# EAGLE design PowerCell-v13 (EAGLE 6.2)
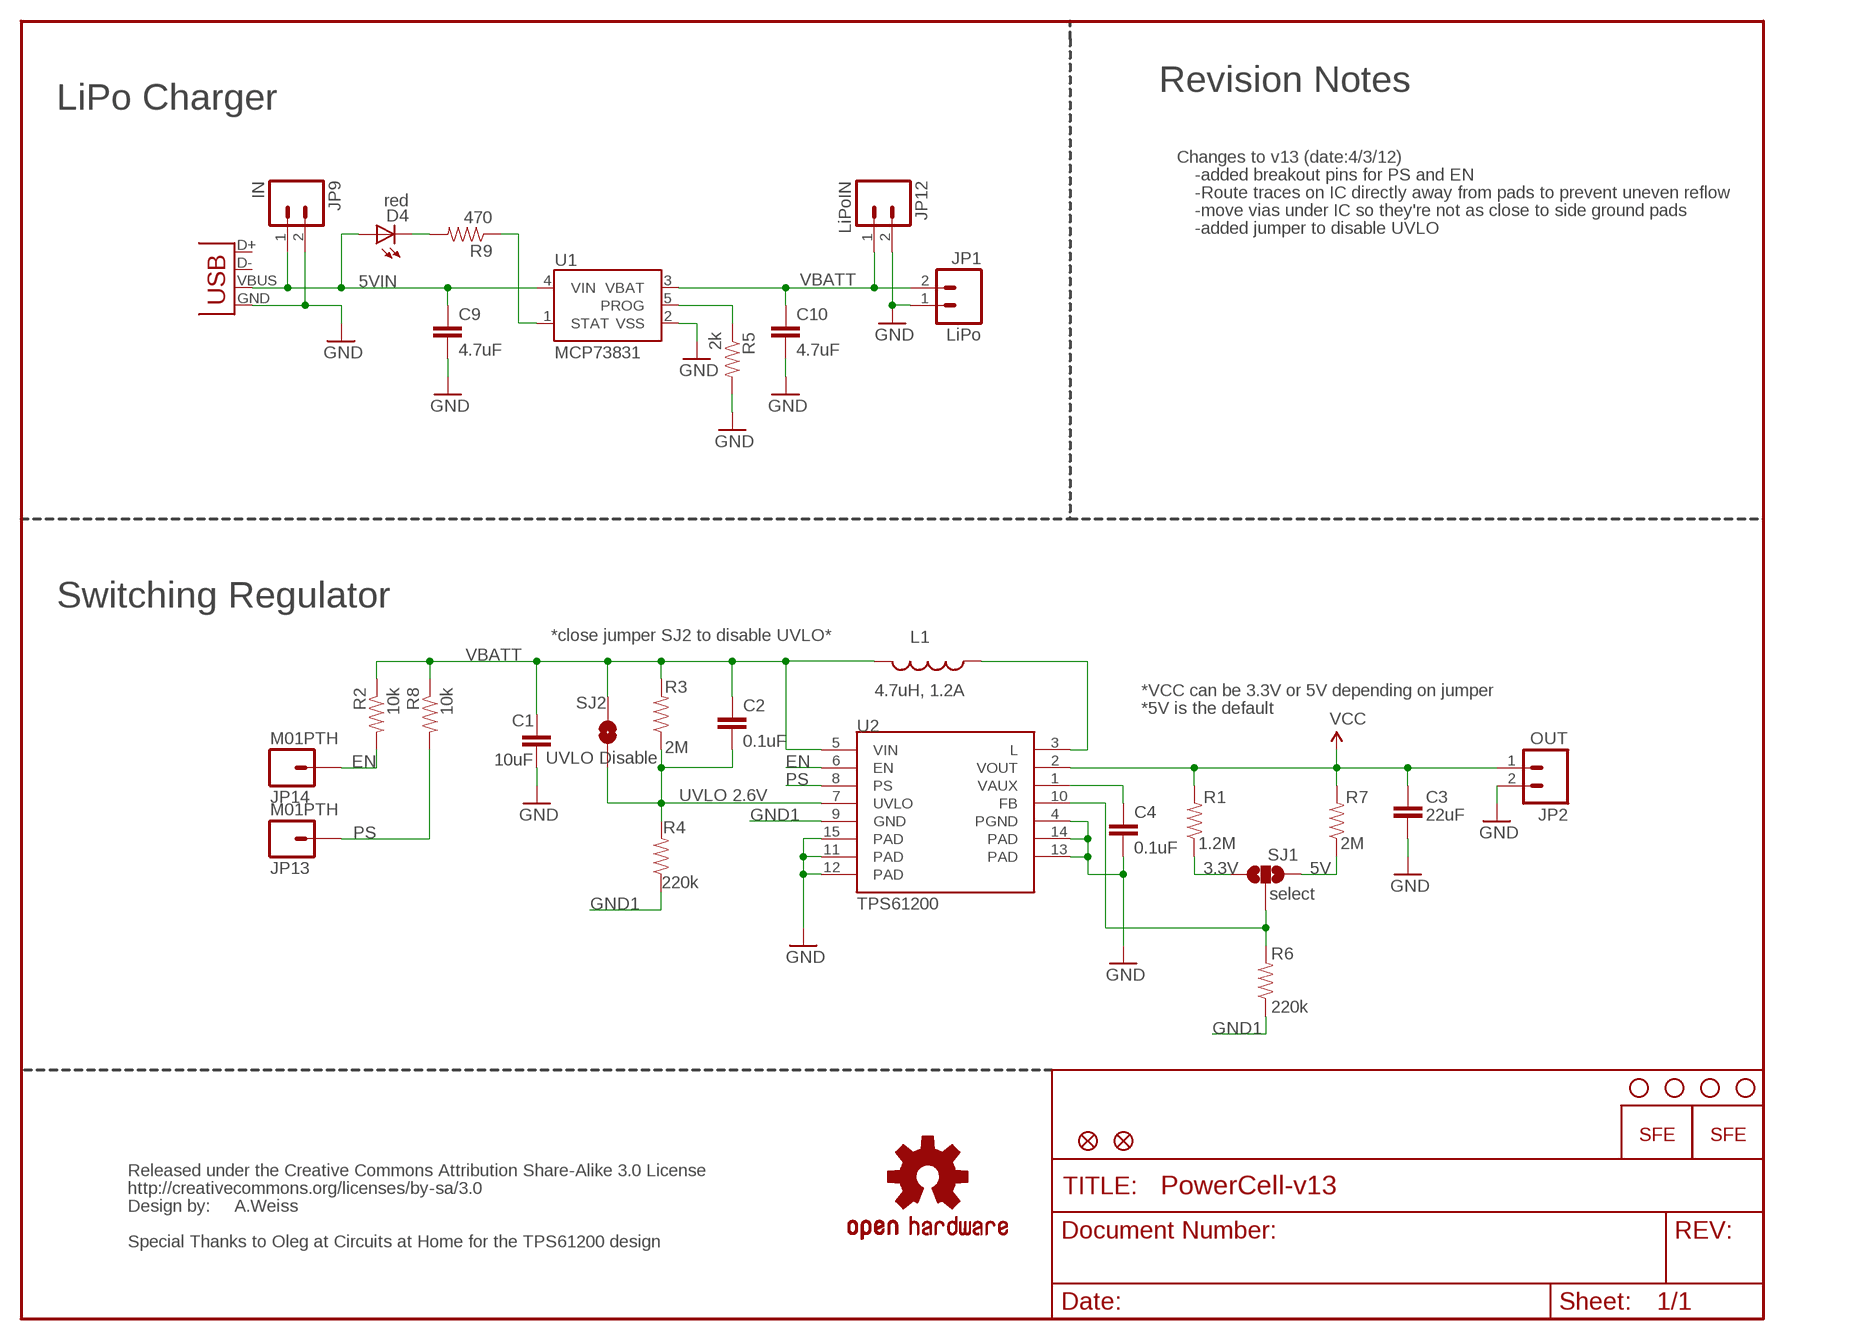
[diagram p0: schematic, sheet 1]

## Parts
C1  10uF  CAP1206  [1206]
C2  0.1uF  CAP0402-CAP  [0402-CAP]
C3  22uF  CAP0805  [0805]
C4  0.1uF  CAP0402-CAP  [0402-CAP]
C9  4.7uF  CAP0402-CAP  [0402-CAP]
C10  4.7uF  CAP0402-CAP  [0402-CAP]
D4  red  LED0603  [LED-0603]
JP1  LiPo  M02-JST-2MM-SMT  [JST-2-SMD]
JP2  OUT  M02PTH  [1X02]
JP3  LOGO-SFENEW  [SFE-NEW-WEBLOGO]
JP4  LOGO-SFESK  [SFE-LOGO-FLAME]
JP5  STAND-OFF  [STAND-OFF]
JP6  STAND-OFF  [STAND-OFF]
JP7  STAND-OFF  [STAND-OFF]
JP8  STAND-OFF  [STAND-OFF]
JP9  IN  M02PTH  [1X02]
JP12  LiPoIN  M02PTH  [1X02]
JP13  M01PTH  [1X01]
JP14  M01PTH  [1X01]
JP15  FIDUCIALUFIDUCIAL  [MICRO-FIDUCIAL]
JP16  FIDUCIALUFIDUCIAL  [MICRO-FIDUCIAL]
L1  4.7uH, 1.2A  INDUCTOR.  [CDRH2D09]
R1  1.2M  RESISTOR0402-RES  [0402-RES]
R2  10k  RESISTOR0402-RES  [0402-RES]
R3  2M  RESISTOR0402-RES  [0402-RES]
R4  220k  RESISTOR0402-RES  [0402-RES]
R5  2k  RESISTOR0402-RES  [0402-RES]
R6  220k  RESISTOR0402-RES  [0402-RES]
R7  2M  RESISTOR0402-RES  [0402-RES]
R8  10k  RESISTOR0402-RES  [0402-RES]
R9  470  RESISTOR0402-RES  [0402-RES]
SJ1  select  SOLDERJUMPER_2WAYPASTE2&3  [SJ_3_PASTE2&3]
SJ2  UVLO Disable  SOLDERJUMPERNO  [SJ_2S-NO]
U1  MCP73831  [SOT23-5]
U2  TPS61200  [QFN-10_PAD]
U$1  OSHW-LOGOS  [OSHW-LOGO-S]
U$2  CREATIVE_COMMONS  [CREATIVE_COMMONS]
X1  USB-MICROB  [USB-MICROB]

## Nets
3.3V: R1.1 SJ1.1
5V: R7.1 SJ1.3
5VIN: C9.1 D4.A JP9.1 U1.4(VIN) X1.VBUS
EN: JP14.1 R2.2 U2.6(EN)
FB: R6.2 SJ1.2 U2.10(FB)
GND: C1.2 C3.2 C4.2 C9.2 C10.2 JP1.1 JP2.2 JP9.2 JP12.2 R5.2 U1.2(VSS) U2.4(PGND) U2.11(PAD) U2.12(PAD) U2.13(PAD) U2.14(PAD) U2.15(PAD) X1.GND
GND1: R4.1 R6.1 U2.9(GND)
N$1: C4.1 U2.1(VAUX)
N$2: L1.P$1 U2.3(L)
N$8: D4.C R9.2
N$11: R5.1 U1.5(PROG)
N$14: R9.1 U1.1(STAT)
PS: JP13.1 R8.2 U2.8(PS)
UVLO: C2.2 R3.1 R4.2 SJ2.1 U2.7(UVLO)
VBATT: C1.1 C2.1 C10.1 JP1.2 JP12.1 L1.P$2 R2.1 R3.2 R8.1 SJ2.2 U1.3(VBAT) U2.5(VIN)
VCC: C3.1 JP2.1 R1.2 R7.2 U2.2(VOUT)
Unconnected: X1.D+ X1.D-

## Notes on the sheet
- Revision Notes
- LiPo Charger
- Changes to v13 (date:4/3/12)
- -added breakout pins for PS and EN
- -Route traces on IC directly away from pads to prevent uneven reflow
- -move vias under IC so they're not as close to side ground pads
- -added jumper to disable UVLO
- Switching Regulator
- *close jumper SJ2 to disable UVLO*
- *VCC can be 3.3V or 5V depending on jumper
- *5V is the default
- UVLO 2.6V
- A.Weiss
- Special Thanks to Oleg at Circuits at Home for the TPS61200 design

## Library data of the parts
C1 C3 = CH_passive:CAP: Capacitor Standard 0603 ceramic capacitor, and 0.1" leaded capacitor.
C2 C4 C9 C10 = SparkFun:CAP: Capacitor Standard 0603 ceramic capacitor, and 0.1" leaded capacitor.
D4 = SparkFun:LED: LEDs Standard schematic elements and footprints for 5mm, 3mm, 1206, and 0603 sized LEDs. 5mm - Spark Fun Electronics SKU : COM-00529 (and others)
JP1 JP2 JP9 JP12 = SparkFun:M02: Header 2 Standard 2-pin 0.1" header. Use with straight break away headers (SKU : PRT-00116), right angle break away headers (PRT-00553), swiss pins (PRT-00743), machine pins (PRT-00117), and female headers (PRT-00115). Molex polarized connector foot print use with SKU : PRT-08233 with associated crimp pins and housings.
JP3 JP4 = SparkFun:LOGO-SFE: Spark Fun Electronics PCB Logo This is the standard Spark Fun Electronics PCB logo.
JP5-JP8 = SparkFun:STAND-OFF: Stand Off This is the mechanical footprint for a #4 phillips button head screw. Use the keepout ring to avoid running the screw head into surrounding components. SKU : PRT-00447
JP13 JP14 = SparkFun:M01: Header 1 Standard 1-pin 0.1" header. Use with straight break away headers (SKU : PRT-00116), right angle break away headers (PRT-00553), swiss pins (PRT-00743), machine pins (PRT-00117), and female headers (PRT-00115).
JP15 JP16 = SparkFun:FIDUCIAL: Fiducial Alignment Points Various fiducial points for machine vision alignment.
L1 = SparkFun:INDUCTOR: Inductors Basic Inductor/Choke - 0603 and 1206. Footprints are not proven and vary greatly between part numbers.
R1-R9 = SparkFun:RESISTOR: Resistor Basic schematic elements and footprints for 0603, 1206, and PTH resistors.
SJ1 = SparkFun:SOLDERJUMPER_2WAY: Solder Jumper 2 way solder jumper
SJ2 = SparkFun-Passives:SOLDERJUMPER: Solder Jumper Standard SMD solder jumper. Used to automate production. Two varients : Normally Open and Normally Closed are the same, but have different paste layers. NC will have a large amount of paste and should jumper during reflow.
U1 = SparkFun:MCP73831: Microchip's MCP73831 Miniature single cell, fully integrated Li-Ion, Li-polymer charge management controller http://ww1.microchip.com/downloads/en/DeviceDoc/21984a.pdf
U2 = SparkFun:TPS61200: DC to DC Booster
U$1 = SparkFun:OSHW-LOGO: Open Source Hardware Logo This logo indicates the piece of hardware it is found on incorporates a OSHW license and/or adheres to the definition of open source hardware found here: http://freedomdefined.org/OSHW
U$2 = SparkFun-Aesthetics:CREATIVE_COMMONS: Creative Commons License summary
X1 = SparkFun:USB: USB Connectors USB-B-PTH is fully proven SKU : PRT-00139 USB-miniB is fully proven SKU : PRT-00587 USB-A-PCB is untested. USB-A-H is throughly reviewed, but untested. Spark Fun Electronics SKU : PRT-00437 USB-B-SMT is throughly reviewed, but untested. Needs silkscreen touching up. USB-A-S has not been used/tested USB-MB-H has not been used/tested

## Board
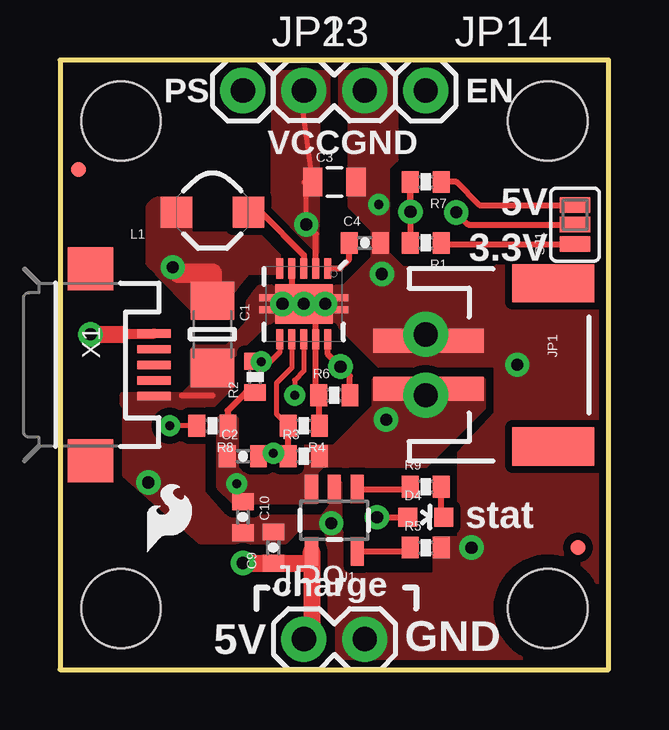
[diagram p1: board, top side]
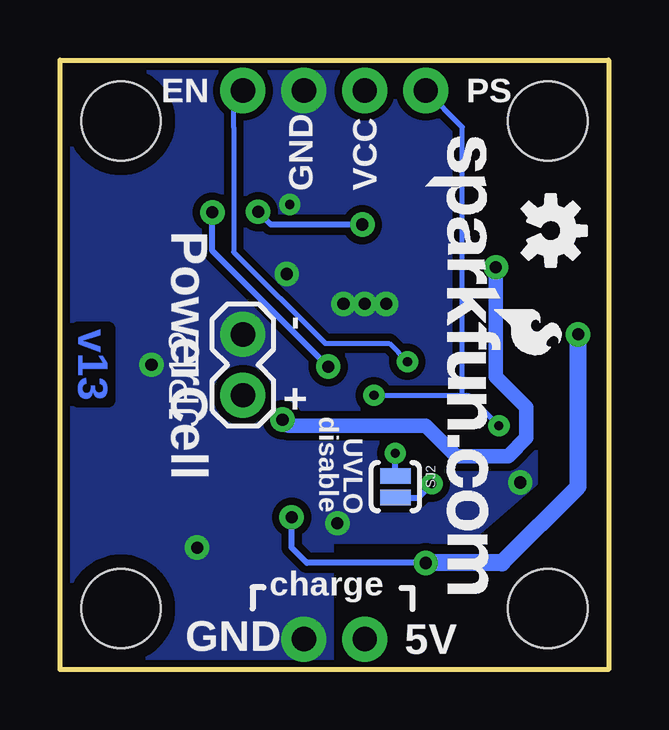
[diagram p2: board, bottom side, seen from below]

Size 22.86 x 25.4 mm. Coordinates in mm from the lower left corner, seen from the top.
Outline: 0,0 22.86,0 22.86,25.4 0,25.4 0,0
Copper layers (1*16): Top 0.035mm / dielectric 1.5mm / Bottom 0.035mm
Design rules: minimum track width 8mil, minimum drill 20mil, track to track 8mil, track to pad 8mil, pad to pad 8mil, via to via 8mil, smd to smd 8mil, copper to edge 8mil, drill to drill 8mil, minimum pad ring 12mil, minimum via ring 10mil, stop-mask expansion 4mil, vias tented up to drill 20mil, thermal gap 10mil

### Footprints (pad centres in the part's own frame; a part is rotated, then mirrored left to right if it is on the bottom)
1206 = smd 1.6 x 1.8: 1 -1.4,0; 2 1.4,0
0402-CAP = smd 0.7 x 0.9: 1 -0.65,0; 2 0.65,0
0805 = smd 0.8 x 1.2: 1 -0.9,0; 2 0.9,0
LED-0603 = smd 0.8 x 0.8: A 0,-0.75; C 0,0.75
JST-2-SMD = smd 1 x 4.6: 1 -1,-3.7; 2 1,-3.7 | smd 1.6 x 3.4: NC1 -3.4,1.5; NC2 3.4,1.5
1X02 = drill 1.016 pad 1.88: 1 0,0; 2 2.54,0
STAND-OFF = hole 3.302: 0,0
1X01 = drill 1.016 pad 1.88: 1 0,0
MICRO-FIDUCIAL = smd 0.635 x 0.635: 1 0,0
CDRH2D09 = smd 1.3 x 1.3: P$1 -1.5,0; P$2 1.5,0
0402-RES = smd 0.7 x 0.9: 1 -0.65,0; 2 0.65,0
SJ_3_PASTE2&3 = smd 0.635 x 1.27: 1 -0.813,0; 2 0,0; 3 0.813,0
SJ_2S-NO = smd 0.635 x 1.27: 1 -0.45,0; 2 0.45,0
SOT23-5 = smd 0.55 x 1.2: 1 -0.95,-1.3; 2 0,-1.3; 3 0.95,-1.3; 4 0.95,1.3; 5 -0.95,1.3
QFN-10_PAD = smd 0.297 x 0.85: 1 -1,-1.475; 2 -0.5,-1.475; 3 0,-1.475; 4 0.5,-1.475; 5 1,-1.475; 6 1,1.475; 7 0.5,1.475; 8 0,1.475; 9 -0.5,1.475; 10 -1,1.475 | smd 0.7 x 0.28: 11 -1.5,0.25; 12 -1.5,-0.25; 13 1.5,0.25; 14 1.5,-0.25 | smd 2.4 x 1.65: 15 0,0
USB-MICROB = smd 0.35 x 1.4: D+ 0,2.65; D- -0.65,2.65; GND 1.3,2.65; ID 0.65,2.65; VBUS -1.3,2.65 | smd 1.8 x 1.9: MT1 -4,0; MT2 4,0

### Placement (x,y rotation side)
C1  6.35,13.97 270 top
C2  7.62,8.89 0 top
C3  11.43,20.32 0 top
C4  12.7,17.78 0 top
C9  8.89,5.08 90 top
C10  7.62,6.35 270 top
D4  15.24,6.35 270 top
JP1  19.05,12.7 270 top
JP2  10.16,24.13 0 top
JP3  7.65,22.2 270 bottom
JP4  3.63,4.9 0 top
JP5  2.54,2.54 0 top
JP6  20.32,2.54 0 top
JP7  2.54,22.86 0 top
JP8  20.32,22.86 0 top
JP9  10.16,1.27 0 top
JP12  15.24,11.43 90 bottom
JP13  7.62,24.13 0 top
JP14  15.24,24.13 0 top
JP15  21.59,5.08 0 top
JP16  0.76,20.83 0 top
L1  6.35,19.05 180 top
R1  15.24,17.78 180 top
R2  8.13,12.19 90 top
R3  10.16,8.89 0 top
R4  10.16,10.16 180 top
R5  15.24,5.08 0 top
R6  11.43,11.43 0 top
R7  15.24,20.32 180 top
R8  6.35,10.16 180 top
R9  15.24,7.62 0 top
SJ1  21.46,18.54 90 top
SJ2  8.89,7.62 270 bottom
U1  11.43,6.22 180 top
U2  10.16,15.24 180 top
U$1  2.41,18.29 270 bottom
U$2  19.05,-10.16 0 top  (outside the outline)
X1  1.27,12.7 270 top

### Tracks (layer width: path | path; a pad name or v marks a point on that pad's centre or on a via)
3.3V
  Top 0.254: SJ1.1 15.94,17.73 R1.1
5V
  Top 0.254: SJ1.3 17.48,19.36 16.51,20.32 R7.1
5VIN  (via drill 0.51)
  Top 0.254: v13.21,6.35 D4.A
  Top 0.406: X1.VBUS 2.57,14 2.54,13.97
  Top 0.61: v7.62,4.45 7.63,4.43 | 10.4,4.43 10.41,4.45 10.41,4.86 U1.4
  Top 0.711: 7.63,4.43 C9.1 10.4,4.43 | U1.4 10.48,1.59 JP9.1 | v1.27,13.97 2.54,13.97
  Bottom 0.254: v13.21,6.35 13.21,5.08 12.57,4.45 v7.62,4.45
  Bottom 0.711: v7.62,4.45 4.45,4.45 1.27,7.62 v1.27,13.97
EN  (via drill 0.38)
  Top 0.203: R2.2 8.37,12.84 v8.38,12.83 8.76,12.83 9.02,13.08 9.16,13.22 U2.6
  Bottom 0.203: v8.38,12.83 9.14,13.59 11.81,13.59 15.62,17.4 15.62,22.61 15.62,23.75 JP14.1
FB  (via drill 0.51)
  Top 0.254: SJ1.2 17.02,18.54 v16.51,19.05 | U2.10 11.16,13.15 v11.68,12.62 12.08,12.23 R6.2
  Bottom 0.254: v16.51,19.05 16.51,17.45 v11.68,12.62
GND  (via drill 0.38, 0.51)
  Top 0.254: U2.4 9.66,15.74 U2.15 | 5.08,11.43 6.35,11.43 | 3.95,11.43 X1.GND
  other vias: 9.27,15.24 11.05,15.24 10.16,15.24 19.05,12.7 13.41,16.48 11.3,6.1 3.68,7.8 17.14,5.08 13.28,19.38
  pour Bottom (isolate 0.305, no thermals): 0,25.4 0,15.24 3.05,15.24 3.05,7.75 5.84,5.33 11.56,5.33 11.56,0 22.86,0 22.86,25.4
  pour Top (isolate 0.305, no thermals): 2.62,11.05 2.62,11.46 5.16,11.46 5.54,11.84 5.54,13.31 5.66,13.44 6.96,13.44 7.59,14.07 7.49,14.07 7.87,14.5 7.87,15.32 8.18,15.75 8.23,15.8 8.33,15.93 8.56,15.93 11.89,15.95 13.08,17.14 13.08,18.31 12.12,19.28 12.12,22.91 11.71,23.32 11.71,25.4 13.97,25.4 13.97,21.26 13.61,20.9 13.61,17.32 14.22,16.71 17.58,16.69 18.41,16.74 18.29,12.7 13.31,12.7 11.51,14.5 8.61,14.5 7.14,13.03 7.14,11.81 6.38,11.05
  pour Top (isolate 0.305, no thermals): 2.67,11.05 2.67,8.13 5.84,5.33 9.4,5.33 9.91,5.84 11.05,5.84 11.56,5.33 11.56,0 22.86,0 22.86,16.76 18.16,16.76 18.16,10.67 16.64,9.02 16.64,3.94 11.94,3.94 11.68,4.19 11.68,7.75 11.56,7.87 11.43,7.87 11.3,7.75 11.3,6.86 10.92,6.35 6.86,6.35 5.97,7.37 5.97,11.05
  pour Top (isolate 0.305, no thermals): 16.51,5.46 15.62,5.46 15.62,4.06 16.64,4.06 16.64,5.33
  pour Top (isolate 0.305, no thermals): 10.9,5.87 10.9,5.84 11.15,5.59 11.15,2.39 11.48,2.06 11.58,2.06 11.76,2.24 11.71,5.71 11.58,5.89 11.58,6.2 11.43,6.35 11.38,6.35
GND1
  Top 0.254: 10.67,14.61 10.66,14.6 U2.9 10.66,11.55 R6.1 10.78,10.19 R4.1
N$1
  Top 0.254: U2.1 11.69,16.71 12.05,17.08 C4.1
N$2
  Top 0.254: U2.3 10.16,17.27 8.38,19.05 L1.P$1
N$8
  Top 0.254: R9.2 15.89,6.45 D4.C
N$11
  Top 0.254: U1.5 14.43,4.92 R5.1
N$14
  Top 0.254: U1.1 14.49,7.52 R9.1
PS  (via drill 0.38)
  Top 0.203: R8.2 v4.57,10.16 | U2.8 10.16,12.45 9.78,12.06 v9.78,11.43
  Bottom 0.203: v9.78,11.43 6.1,11.43 | 6.1,11.43 6.1,22.61 JP13.1 | 6.1,11.43 5.84,11.43 v4.57,10.16
UVLO  (via drill 0.38)
  Top 0.203: U2.7 9.66,12.58 9.02,11.94 9.02,10.65 R4.2
  Top 0.254: C2.2 8.76,8.89 v8.89,9.02 9.02,8.89 R3.1 R4.2 9.66,10.31
  Bottom 0.254: SJ2.1 v8.89,9.02
VBATT  (via drill 0.38, 0.51)
  Top 0.254: R2.1 7.73,11.54 6.99,10.79 6.99,10.18 R8.1
  Top 0.813: C1.1 6.35,16.51 4.95,16.51 v4.7,16.76
  Top 1.016: 14.88,11.7 JP1.2
  Bottom 0.254: SJ2.2 7.94,7.17 v7.37,7.75
  Bottom 0.61: v4.7,16.76 4.7,13.08 4.7,12.19 3.43,10.92 3.43,9.65 4.19,8.89 6.35,8.89 7.62,10.16 13.34,10.16 v13.59,10.41
  pour Top (isolate 0.305, no thermals): 8.2,18.16 9.19,17.14 9.19,16.54 7.8,16.54 7.52,16.18 7.11,15.65 7.14,14.66 5.74,14.66 5.54,14.86 5.54,15.01 4.06,16.48 4.06,16.51 3.68,16.89 3.68,19.3 3.94,19.56 4.06,19.61 5.41,19.61 5.41,18.16
  pour Top (isolate 0.305, no thermals): 13.08,12.06 13.08,10.92 11.43,9.27 9.27,9.27 9.14,9.14 9.14,8.38 8.89,8.13 7.62,8.13 7.37,8.38 7.37,10.41 7.24,10.54 6.73,10.54 6.6,10.41 6.6,7.62 7.24,6.99 10.67,6.99 10.67,8.26 10.92,8.51 15.24,8.51 17.65,10.92 17.65,12.06
VCC  (via drill 0.51)
  Top 0.203: v10.26,18.54 10.26,20.22 10.16,20.32 | C3.1 10.03,24 JP2.1
  Top 0.254: R1.2 R7.2 14.59,19.09 v14.61,19.07 | U2.2 10.66,18.14 v10.26,18.54
  Bottom 0.254: v10.26,18.54 14.07,18.54 v14.61,19.07
  pour Top (isolate 0.305, no thermals): 8.89,25.4 8.86,19.18 10.72,17.27 10.72,17.17 10.77,23.06 11.18,23.47 11.18,25.4

### Text on the board
Bottom: v13
tPlace: PS | EN | VCC | GND | 5V | 3.3V | stat | charge | 5V | GND
bPlace: EN | PS | VCC | GND | PowerCell | - | disable | + | UVLO | charge | 5V | GND